# EAGLE schematic GB202-CC-from-SF-Base (EAGLE 7.2.0)
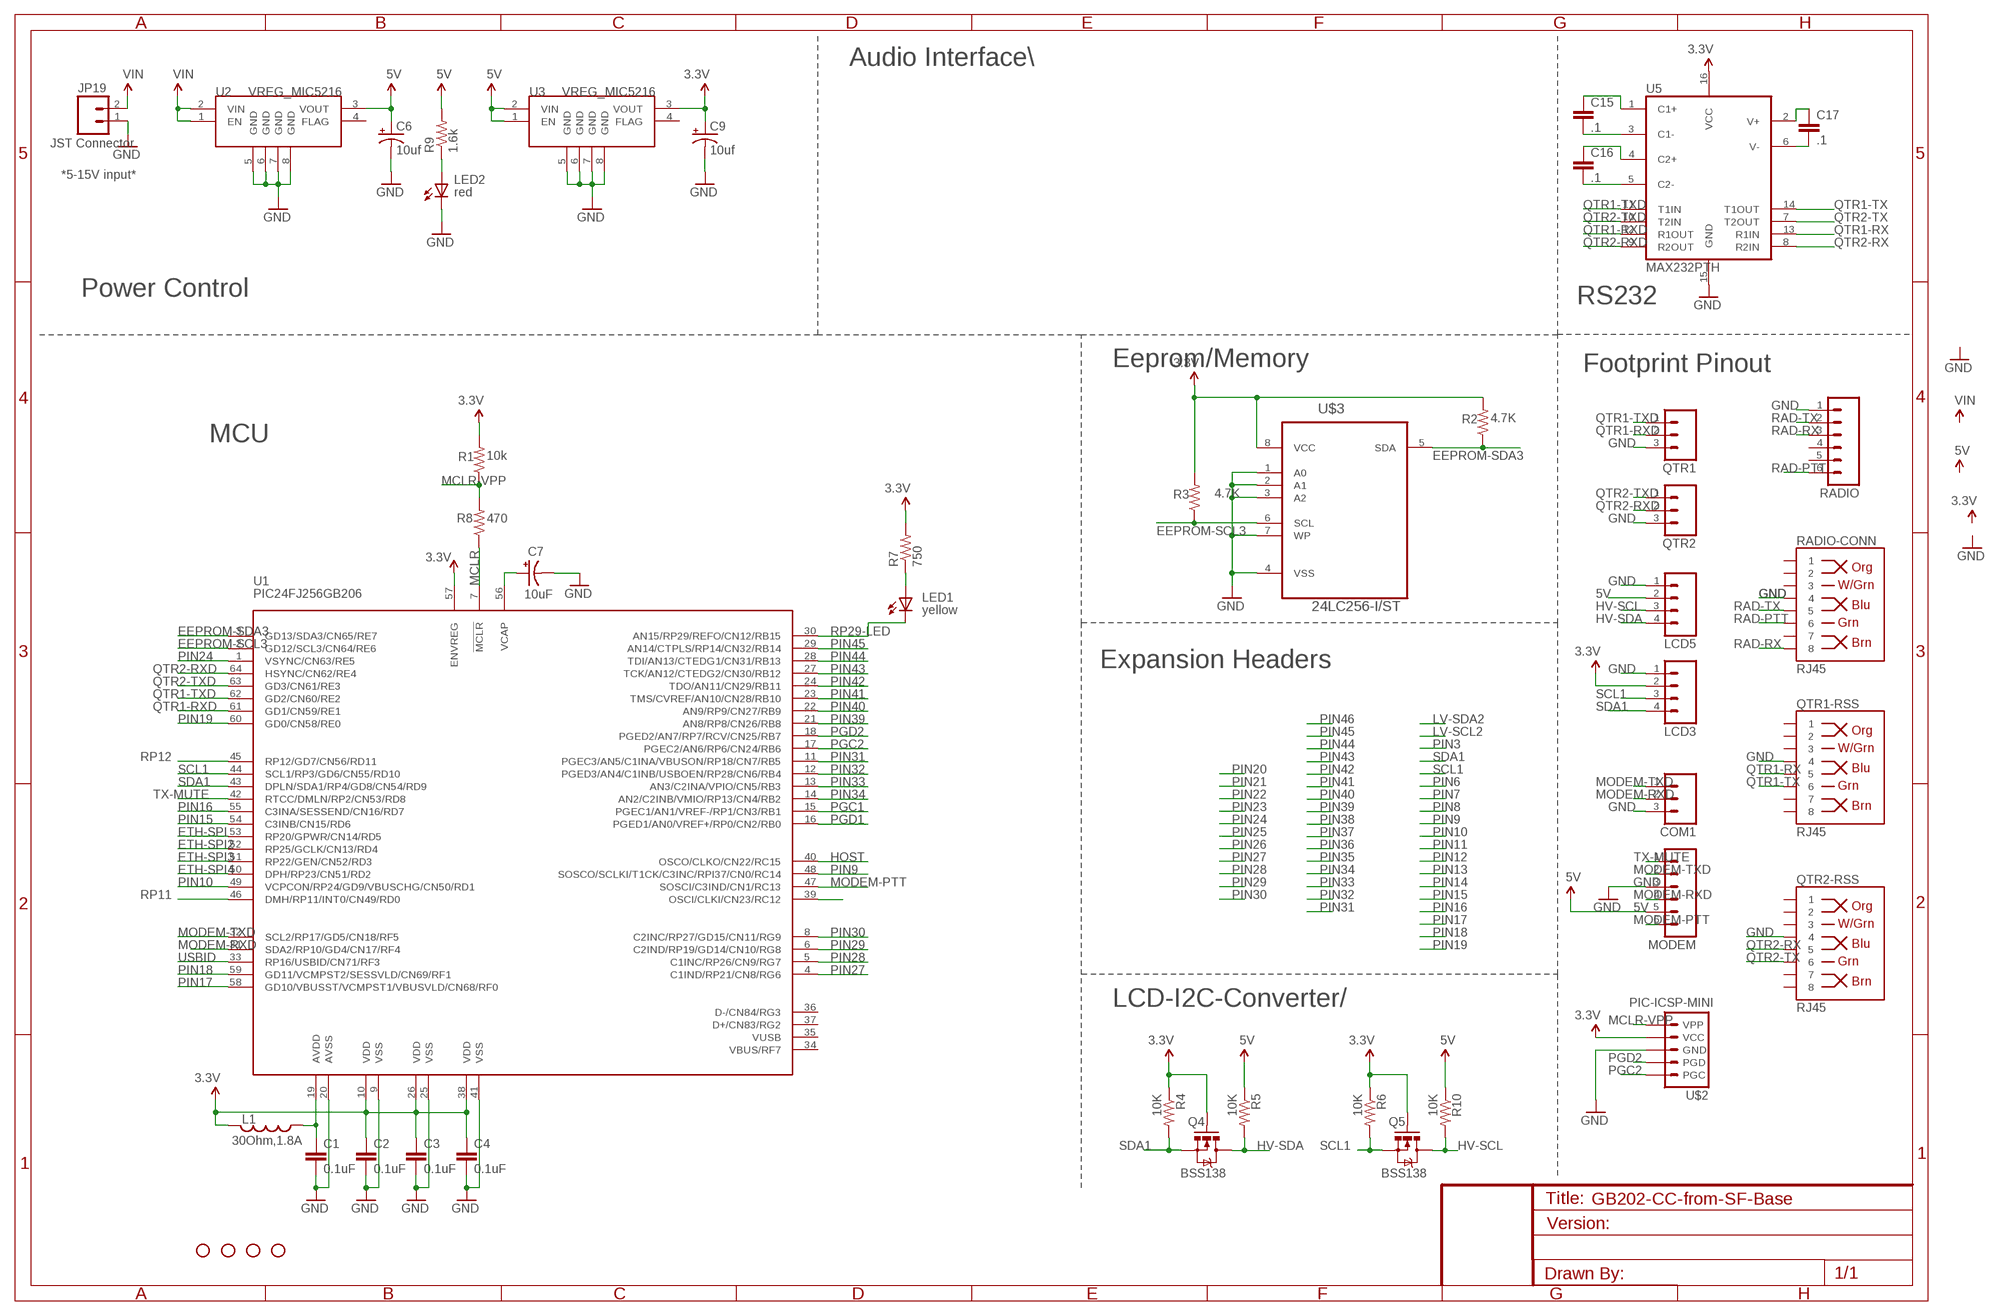
[diagram p0: schematic, sheet 1]

## Parts
C1  0.1uF  CAP0603-CAP  [0603-CAP]
C2  0.1uF  CAP0402-CAP  [0402-CAP]
C3  0.1uF  CAP0603-CAP  [0603-CAP]
C4  0.1uF  CAP0402-CAP  [0402-CAP]
C6  10uf  CAP_POL1206  [EIA3216]
C7  10uF  CAP_POL1206  [EIA3216]
C9  10uf  CAP_POL1206  [EIA3216]
C15  .1  CAPPTH  [CAP-PTH-SMALL]
C16  .1  CAPPTH  [CAP-PTH-SMALL]
C17  .1  CAPPTH  [CAP-PTH-SMALL]
COM1  M031X03_NO_SILK  [1X03_NO_SILK]
JP10  STAND-OFF  [STAND-OFF]
JP11  STAND-OFF  [STAND-OFF]
JP12  STAND-OFF  [STAND-OFF]
JP13  STAND-OFF  [STAND-OFF]
JP19  JST Connector  M02-JST-2MM-SMT  [JST-2-SMD]
L1  30Ohm,1.8A  INDUCTOR0603  [0603]
LCD3  M04LONGPADS  [1X04_LONGPADS]
LCD5  M04LONGPADS  [1X04_LONGPADS]
LED1  LY L29K-J1K2-26-Z  LED0603  [LED-0603]
LED2  LS L29K-G1J2-1-Z  LED0603  [LED-0603]
MODEM  M06LONGPADS  [1X06_LONGPADS]
Q4  BSS138  MOSFET-NCHANNELSMD  [SOT23-3]
Q5  BSS138  MOSFET-NCHANNELSMD  [SOT23-3]
QTR1  M031X03_NO_SILK  [1X03_NO_SILK]
QTR1-RSS  RJ45  RJ45-8PTH  [RJ45-8]
QTR2  M031X03_NO_SILK  [1X03_NO_SILK]
QTR2-RSS  RJ45  RJ45-8PTH  [RJ45-8]
R1  10k  RESISTOR0603-RES  [0603-RES]
R2  4.7K  R-US_R0402  [R0402]
R3  4.7K  R-US_R0402  [R0402]
R4  10K  RESISTOR0402-RES  [0402-RES]
R5  10K  RESISTOR0603-RES  [0603-RES]
R6  10K  RESISTOR0402-RES  [0402-RES]
R7  750  RESISTOR0603-RES  [0603-RES]
R8  470  RESISTOR0603  [0603-RES]
R9  1.6k  RESISTOR0603-RES  [0603-RES]
R10  10K  RESISTOR0603-RES  [0603-RES]
RADIO  M06LONGPADS  [1X06_LONGPADS]
RADIO-CONN  RJ45  RJ45-8PTH  [RJ45-8]
U1  PIC24FJ256GB206  PIC24FXXXDAX06  [PIC24FXXX_TQFP64]
U2  VREG_MIC5216  [MSOP8]
U3  VREG_MIC5216  [MSOP8]
U5  MAX232PTH  [DIL16]
U$2  PIC-ICSP-MINI  [PIC-ICSP-MINI]
U$3  24LC256-I/ST  [SOP65P638X110-8N]

## Nets
3.3V: C2.1 C3.1 C4.1 C9.A(+) L1.2 LCD3.2 Q4.1(G) Q5.1(G) R1.2 R2.2 R3.2 R4.1 R6.1 R7.2 U1.10(VDD) U1.26(VDD) U1.38(VDD) U1.57(ENVREG) U3.3(VOUT) U5.16(VCC) U$2.2(VCC) U$3.8(VCC)
5V: C6.A(+) LCD5.2 MODEM.5 R5.1 R9.2 R10.1 U2.3(VOUT) U3.1(EN) U3.2(VIN)
EEPROM-SCL3: R3.1 U1.2(GD12/SCL3/CN64/RE6) U$3.6(SCL)
EEPROM-SDA3: R2.1 U1.3(GD13/SDA3/CN65/RE7) U$3.5(SDA)
ETH-SPI: U1.53(RP20/GPWR/CN14/RD5)
ETH-SPI2: U1.52(RP25/GCLK/CN13/RD4)
ETH-SPI3: U1.51(RP22/GEN/CN52/RD3)
ETH-SPI4: U1.50(DPH/RP23/CN51/RD2)
GND: C1.2 C2.2 C3.2 C4.2 C6.C(-) C7.C(-) C9.C(-) COM1.3 JP19.1 LCD3.1 LCD5.1 LED2.C MODEM.3 QTR1-RSS.4 QTR1.3 QTR2-RSS.4 QTR2.3 RADIO-CONN.4 RADIO.1 U1.9(VSS) U1.20(AVSS) U1.25(VSS) U1.41(VSS) U2.5(GND) U2.6(GND) U2.7(GND) U2.8(GND) U3.5(GND) U3.6(GND) U3.7(GND) U3.8(GND) U5.15(GND) U$2.3(GND) U$3.1(A0) U$3.2(A1) U$3.3(A2) U$3.4(VSS) U$3.7(WP)
HOST: U1.40(OSCO/CLKO/CN22/RC15)
HV-SCL: LCD5.3 Q5.3(D) R10.2
HV-SDA: LCD5.4 Q4.3(D) R5.2
MCLR: R8.1 U1.7(!MCLR)
MCLR-VPP: R1.1 R8.2 U$2.1(VPP)
MODEM-PTT: MODEM.6 U1.47(SOSCI/C3IND/CN1/RC13)
MODEM-RXD: COM1.2 MODEM.4 U1.31(SDA2/RP10/GD4/CN17/RF4)
MODEM-TXD: COM1.1 MODEM.2 U1.32(SCL2/RP17/GD5/CN18/RF5)
N$1: U1.39(OSCI/CLKI/CN23/RC12)
N$2: LED1.A R7.1
N$3: LED2.A R9.1
N$5: C7.A(+) U1.56(VCAP)
N$9: C1.1 L1.1 U1.19(AVDD)
N$23: C15.1 U5.1(C1+)
N$25: C15.2 U5.3(C1-)
N$26: C16.1 U5.4(C2+)
N$27: C16.2 U5.5(C2-)
N$28: C17.2 U5.6(V-)
N$29: C17.1 U5.2(V+)
PGC1: U1.15(PGEC1/AN1/VREF-/RP1/CN3/RB1)
PGC2: U1.17(PGEC2/AN6/RP6/CN24/RB6) U$2.5(PGC)
PGD1: U1.16(PGED1/AN0/VREF+/RP0/CN2/RB0)
PGD2: U1.18(PGED2/AN7/RP7/RCV/CN25/RB7) U$2.4(PGD)
PIN9: U1.48(SOSCO/SCLKI/T1CK/C3INC/RPI37/CN0/RC14)
PIN10: U1.49(VCPCON/RP24/GD9/VBUSCHG/CN50/RD1)
PIN15: U1.54(C3INB/CN15/RD6)
PIN16: U1.55(C3INA/SESSEND/CN16/RD7)
PIN17: U1.58(GD10/VBUSST/VCMPST1/VBUSVLD/CN68/RF0)
PIN18: U1.59(GD11/VCMPST2/SESSVLD/CN69/RF1)
PIN19: U1.60(GD0/CN58/RE0)
PIN24: U1.1(VSYNC/CN63/RE5)
PIN27: U1.4(C1IND/RP21/CN8/RG6)
PIN28: U1.5(C1INC/RP26/CN9/RG7)
PIN29: U1.6(C2IND/RP19/GD14/CN10/RG8)
PIN30: U1.8(C2INC/RP27/GD15/CN11/RG9)
PIN31: U1.11(PGEC3/AN5/C1INA/VBUSON/RP18/CN7/RB5)
PIN32: U1.12(PGED3/AN4/C1INB/USBOEN/RP28/CN6/RB4)
PIN33: U1.13(AN3/C2INA/VPIO/CN5/RB3)
PIN34: U1.14(AN2/C2INB/VMIO/RP13/CN4/RB2)
PIN39: U1.21(AN8/RP8/CN26/RB8)
PIN40: U1.22(AN9/RP9/CN27/RB9)
PIN41: U1.23(TMS/CVREF/AN10/CN28/RB10)
PIN42: U1.24(TDO/AN11/CN29/RB11)
PIN43: U1.27(TCK/AN12/CTEDG2/CN30/RB12)
PIN44: U1.28(TDI/AN13/CTEDG1/CN31/RB13)
PIN45: U1.29(AN14/CTPLS/RP14/CN32/RB14)
QTR1-RX: QTR1-RSS.5 U5.13(R1IN)
QTR1-RXD: QTR1.2 U1.61(GD1/CN59/RE1) U5.12(R1OUT)
QTR1-TX: QTR1-RSS.6 U5.14(T1OUT)
QTR1-TXD: QTR1.1 U1.62(GD2/CN60/RE2) U5.11(T1IN)
QTR2-RX: QTR2-RSS.5 U5.8(R2IN)
QTR2-RXD: QTR2.2 U1.64(HSYNC/CN62/RE4) U5.9(R2OUT)
QTR2-TX: QTR2-RSS.6 U5.7(T2OUT)
QTR2-TXD: QTR2.1 U1.63(GD3/CN61/RE3) U5.10(T2IN)
RAD-PTT: RADIO-CONN.6 RADIO.6
RAD-RX: RADIO-CONN.8 RADIO.3
RAD-TX: RADIO-CONN.5 RADIO.2
RP11: U1.46(DMH/RP11/INT0/CN49/RD0)
RP12: U1.45(RP12/GD7/CN56/RD11)
RP29-LED: LED1.C U1.30(AN15/RP29/REFO/CN12/RB15)
SCL1: LCD3.3 Q5.2(S) R6.2 U1.44(SCL1/RP3/GD6/CN55/RD10)
SDA1: LCD3.4 Q4.2(S) R4.2 U1.43(DPLN/SDA1/RP4/GD8/CN54/RD9)
TX-MUTE: MODEM.1 U1.42(RTCC/DMLN/RP2/CN53/RD8)
USBID: U1.33(RP16/USBID/CN71/RF3)
VIN: JP19.2 U2.1(EN) U2.2(VIN)
Unconnected: QTR1-RSS.1 QTR1-RSS.2 QTR1-RSS.3 QTR1-RSS.7 QTR1-RSS.8 QTR2-RSS.1 QTR2-RSS.2 QTR2-RSS.3 QTR2-RSS.7 QTR2-RSS.8 RADIO-CONN.1 RADIO-CONN.2 RADIO-CONN.3 RADIO-CONN.7 RADIO.4 RADIO.5 U1.34(VBUS/RF7) U1.36(D-/CN84/RG3) U1.37(D+/CN83/RG2) U2.4(FLAG) U3.4(FLAG)

## Notes on the sheet
- Audio Interface\
- *5-15V input*
- red
- Power Control
- RS232
- Eeprom/Memory | Footprint Pinout
- MCU
- yellow
- Expansion Headers
- LCD-I2C-Converter/

## Power pins joined to a net without a drawn wire
VUSB: U1.35(VUSB)

## Library data of the parts
C1-C4 C15-C17 = SparkFun-Capacitors:CAP: Capacitor Standard 0603 ceramic capacitor, and 0.1" leaded capacitor.
C6 C9 = SparkFun-Capacitors:CAP_POL: Capacitor Polarized These are standard SMD and PTH capacitors. Normally 10uF, 47uF, and 100uF in electrolytic and tantalum varieties. Always verify the external diameter of the through hole cap, it varies with capacity, voltage, and manufacturer. The EIA devices should be standard.
C7 = SparkFun:CAP_POL: Capacitor Polarized These are standard SMD and PTH capacitors. Normally 10uF, 47uF, and 100uF in electrolytic and tantalum varieties. Always verify the external diameter of the through hole cap, it varies with capacity, voltage, and manufacturer. The EIA devices should be standard.
COM1 QTR1 QTR2 = SparkFun-Connectors:M03: Header 3 Standard 3-pin 0.1" header. Use with straight break away headers (SKU : PRT-00116), right angle break away headers (PRT-00553), swiss pins (PRT-00743), machine pins (PRT-00117), and female headers (PRT-00115). Molex polarized connector foot print use with SKU : PRT-08232 with associated crimp pins and housings.
JP10-JP13 = SparkFun:STAND-OFF: Stand Off This is the mechanical footprint for a #4 phillips button head screw. Use the keepout ring to avoid running the screw head into surrounding components. SKU : PRT-00447
JP19 = SparkFun:M02: Header 2 Standard 2-pin 0.1" header. Use with straight break away headers (SKU : PRT-00116), right angle break away headers (PRT-00553), swiss pins (PRT-00743), machine pins (PRT-00117), and female headers (PRT-00115). Molex polarized connector foot print use with SKU : PRT-08233 with associated crimp pins and housings.
L1 = SparkFun-Passives:INDUCTOR: Inductors Basic Inductor/Choke - 0603 and 1206. Footprints are not proven and vary greatly between part numbers. SRN6045- 33uH, 20% 1.4A
LCD3 LCD5 = SparkFun-Connectors:M04: Header 4 Standard 4-pin 0.1" header. Use with straight break away headers (SKU : PRT-00116), right angle break away headers (PRT-00553), swiss pins (PRT-00743), machine pins (PRT-00117), and female headers (PRT-00115). Molex polarized connector foot print use with SKU : PRT-08231 with associated crimp pins and housings. 1MM SMD Version SKU: PRT-10208; PROD_ID: CONN-09696
LED1 = SparkFun-LED:LED: LEDs Standard schematic elements and footprints for 5mm, 3mm, 1206, and 0603 sized LEDs. 5mm - Spark Fun Electronics SKU : COM-00529 (and others)
LED2 = SparkFun:LED: LEDs Standard schematic elements and footprints for 5mm, 3mm, 1206, and 0603 sized LEDs. 5mm - Spark Fun Electronics SKU : COM-00529 (and others)
MODEM RADIO = SparkFun-Connectors:M06: Header 6 Standard 6-pin 0.1" header. Use with straight break away headers (SKU : PRT-00116), right angle break away headers (PRT-00553), swiss pins (PRT-00743), machine pins (PRT-00117), and female headers (PRT-00115). Molex polarized connector foot print use with SKU : PRT-08094 with associated crimp pins and housings. NOTES ON THE VARIANTS LOCK and LOCK_LONGPADS... This footprint was designed to help hold the alignment of a through-hole component (i.e. 6-pin header) while soldering it into place. You may notice that each hole has been shifted either up or down by 0.005 of an inch from it's more standard position (which is a perfectly straight line). This slight alteration caused the pins (the squares in the middle) to touch the edges of the holes. Because they are alternating, it causes a "brace" to hold the component in place. 0.005 has proven to be the perfect amount of "off-center" position when using our standard breakaway headers. Although looks a little odd when you look at the bare footprint, once you have a header in there, the alteration is very hard to notice. Also,if you push a header all the way into place, it is covered up entirely on the bottom side. This idea of altering the position of holes to aid alignment will be further integrated into the Sparkfun Library for other footprints. It can help hold any component with 3 or more connection pins.
Q4 Q5 = SparkFun:MOSFET-NCHANNEL
QTR1-RSS QTR2-RSS RADIO-CONN = SparkFun-Connectors:RJ45-8: RJ45 Jack Simple RJ45, 8-pin connection - connector for common Cat5, Cat5e, and Cat6 Ethernet cables. Footprint not yet proven in production. Connector sku is PRT-00643; Breakout PCB sku is BOB-00716.; PROD_ID: CONN-08506
R1 R7-R9 = SparkFun-Resistors:RESISTOR: Resistor Basic schematic elements and footprints for 0603, 1206, and PTH resistors.
R2 R3 = rcl:R-US_: RESISTOR, American symbol
R4-R6 R10 = SparkFun:RESISTOR: Resistor Basic schematic elements and footprints for 0603, 1206, and PTH resistors.
U1 = SparkFun-DigitalIC:PIC24FXXXDAX06: PIC24FXXXDAX06 PIC24FXXXDA106 / PIC24FXXXDA206
U2 U3 = SparkFun-PowerIC:VREG_MIC5216: 500mA LDO, MSOP8 for better dissipation
U5 = SparkFun-DigitalIC:MAX232: RS232 Transceiver Very common IC. This is generically called 'MAX232', but works with the 3V equivalent MAX3232 generic ICs. Field tested and mother approved. Spark Fun Electronics SKU : COM-00316 (DIP) and COM-00589 (SMD)
U$2 = SparkFun-Connectors:PIC-ICSP-MINI: PIC-ICSP-Mini Miniature 5-pin connection for temporary programming of PICs. Use this device in your design to save space. Program the PIC with this adapter Spark Fun Electronics SKU : BOB-00194
U$3 = Microchip_By_element14_Batch_1:24LC256-I/ST: 256K I2C CMOS Serial EEPROM; DESCRIPTION: EEPROM; MPN: 24LC256-I/ST; OC_FARNELL: 1296579; OC_NEWARK: 27C9145; PACKAGE: TSSOP-8; SUPPLIER: Microchip